# Altium schematic sheet MainSchDoc.SchDoc
size A
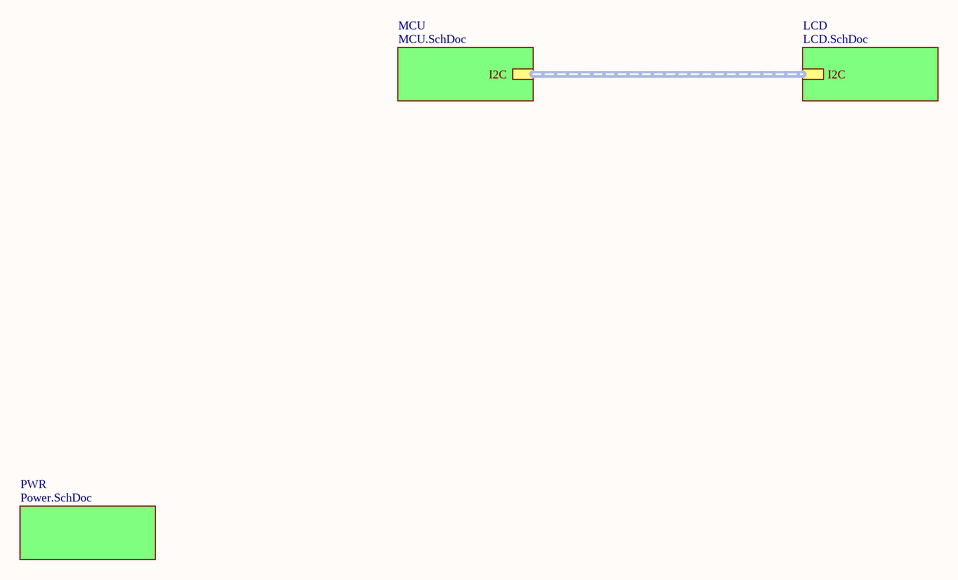
[diagram p0: MainSchDoc.SchDoc]

## Sub-sheets
LCD = LCD.SchDoc: I2C (harness I2C)
MCU = MCU.SchDoc: I2C (harness I2C)
PWR = Power.SchDoc: no entries

## Buses and harness runs
harness sheet LCD/I2C = sheet MCU/I2C